# Altium schematic sheet PD_Sche.SchDoc
size A; SheetNumber: 1; SheetTotal: 1
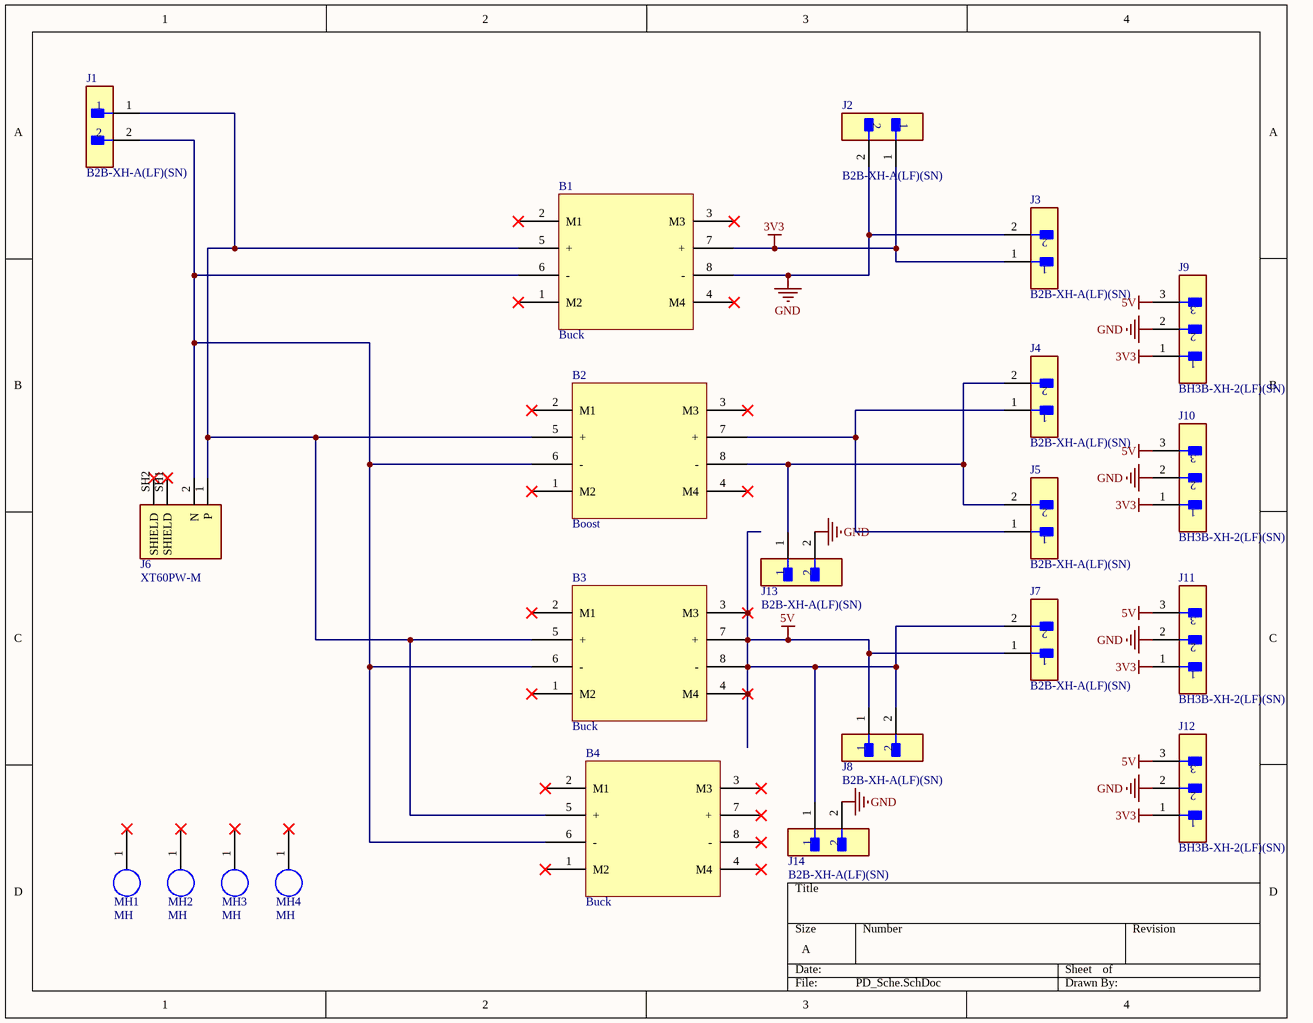
[diagram p0: PD_Sche.SchDoc]

## Parts
B1  Buck  [Buck]
B2  Boost  [Boost]
B3  Buck  [Buck]
B4  Buck  [Buck]
J1  B2B-XH-A(LF)(SN)  [FP-B2B-XH-A_LF_SN-MFG]
J2  B2B-XH-A(LF)(SN)  [FP-B2B-XH-A_LF_SN-MFG]
J3  B2B-XH-A(LF)(SN)  [FP-B2B-XH-A_LF_SN-MFG]
J4  B2B-XH-A(LF)(SN)  [FP-B2B-XH-A_LF_SN-MFG]
J5  B2B-XH-A(LF)(SN)  [FP-B2B-XH-A_LF_SN-MFG]
J6  XT60PW-M  [AMASS_XT60PW-M]
J7  B2B-XH-A(LF)(SN)  [FP-B2B-XH-A_LF_SN-MFG]
J8  B2B-XH-A(LF)(SN)  [FP-B2B-XH-A_LF_SN-MFG]
J9  BH3B-XH-2(LF)(SN)  [FP-BH3B-XH-2_LF_SN-MFG]
J10  BH3B-XH-2(LF)(SN)  [FP-BH3B-XH-2_LF_SN-MFG]
J11  BH3B-XH-2(LF)(SN)  [FP-BH3B-XH-2_LF_SN-MFG]
J12  BH3B-XH-2(LF)(SN)  [FP-BH3B-XH-2_LF_SN-MFG]
J13  B2B-XH-A(LF)(SN)  [FP-B2B-XH-A_LF_SN-MFG]
J14  B2B-XH-A(LF)(SN)  [FP-B2B-XH-A_LF_SN-MFG]
MH1  MH  [MH]
MH2  MH  [MH]
MH3  MH  [MH]
MH4  MH  [MH]

## Nets
3V3: B1.7(+) J2.1 J3.1 J9.1 J10.1 J11.1 J12.1
5V: B3.3(M3) B3.4(M4) B3.7(+) B3.8(-) J7.1 J7.2 J8.1 J8.2 J9.3 J10.3 J11.3 J12.3 J14.1
GND: B1.8(-) J2.2 J3.2 J9.2 J10.2 J11.2 J12.2 J13.2 J14.2
NetB1_5: B1.5(+) B2.5(+) B3.5(+) B4.5(+) J1.1 J6.1(P)
NetB1_6: B1.6(-) B2.6(-) B3.6(-) B4.6(-) J1.2 J6.2(N)
NetB2_7: B2.7(+) J4.1 J5.1
NetB2_8: B2.8(-) J4.2 J5.2 J13.1

Not connected (* = marked no-connect by the designer): B1 1(M2)* 2(M1)* 3(M3)* 4(M4)*; B2 1(M2)* 2(M1)* 3(M3)* 4(M4)*; B3 1(M2)* 2(M1)*; B4 1(M2)* 2(M1)* 3(M3)* 4(M4)* 7(+)* 8(-)*; J6 SH1(SHIELD)* SH2(SHIELD)*; MH1 1*; MH2 1*; MH3 1*; MH4 1*

## Library data of the parts
J1-J5 J7 J8 J13 J14 = CMP-2000-05888-3: CONN HEADER VERT 2POS 2.5MM; Current Rating: 3A; Voltage Rating: 250V; Number of Contacts: 2; Contact Resistance: 20mR; Wire/Cable Gauge: 22AWG; Insulation Resistance: 1GR; Connector Type: Male Pin; Packaging: Bulk; Contact Material: Brass; Lead Free: Lead Free; Orientation: Straight; Contact Plating: Tin; Max Current Rating: 3A; Termination: Solder; Fastening Type: Detent; Depth: 5.75mm; Housing Material: Polyamide; REACH SVHC: No SVHC; Series: XH; Voltage Rating (AC): 250V; Number of Positions: 2; Color: Natural; Contact Type: Male Pin; Max Voltage Rating (DC): 250V; Pitch: 2.5mm; Lead Pitch: 2.5mm; Mount: Through Hole; Max Operating Temperature: 85°C; Length: 7.4mm; Max Voltage Rating (AC): 250V; Min Operating Temperature: -25°C; Number of Rows: 1; Housing Color: White
J6 = XT60PW-M: Socket, DC supply, male, PIN: 2; MF: AMASS; SnapEDA_Link: https://www.snapeda.com/parts/XT60PW-M/AMASS/view-part/?ref=snap; Package: Package; Value: *; MP: XT60PW-M; Check_prices: https://www.snapeda.com/parts/XT60PW-M/AMASS/view-part/?ref=eda
J9-J12 = CMP-17439-000649-1: CONN HEADER VERT 3POS 2.5MM; Voltage Rating: 250V; Number of Positions: 3; Mated Stacking Heights: 9.8mm; Pitch: 2.5mm; Contact Finish - Mating: TIN; Series: XH; Width: 5.75mm; Insulation Material: Nylon; Packaging: Bulk; Min Operating Temperature: -25°C; Connector Type: Header; Insulation Color: Natural; Height: 14.2mm; Contact Material: Brass; Length: 9.9mm; Termination: Press-Fit; Fastening Type: Detent; Number of Poles: 3; Flammability Rating: UL94 V-0; Contact Type: Male Pin; Lead Free: Lead Free; Mount: Through Hole; Number of Rows: 1; Max Operating Temperature: 85°C; Contact Shape: Square